# EAGLE schematic opamp1 (EAGLE 9.5.2)
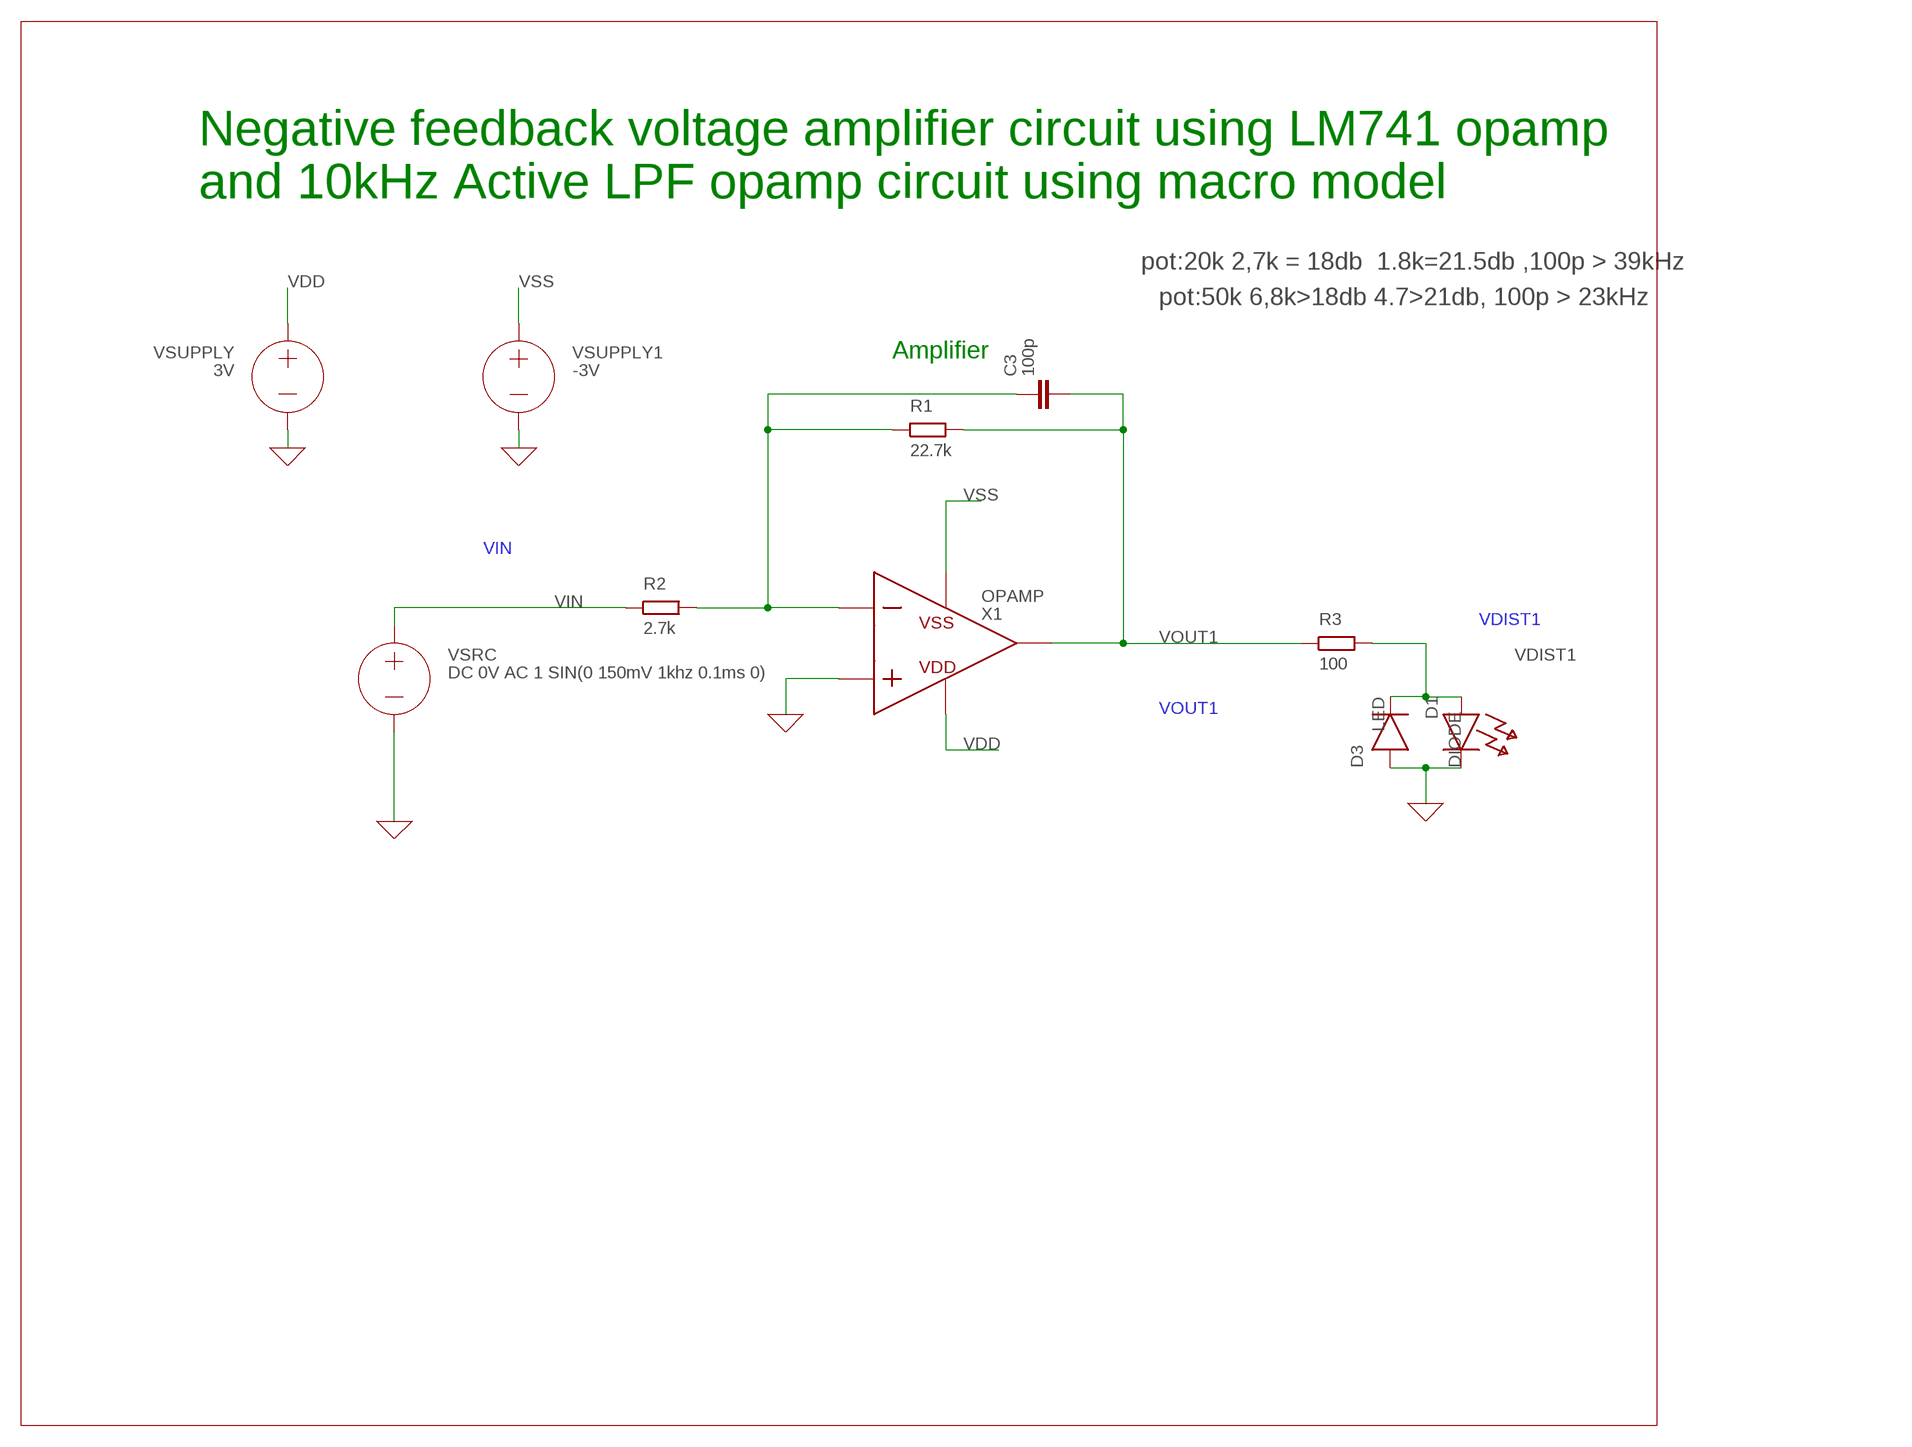
[diagram p0: schematic, sheet 1]

## Parts
C3  100p  C  (no package)
D1  LED  (no package)
D3  DIODE  (no package)
R1  22.7k  R  (no package)
R2  2.7k  R  (no package)
R3  100  R  (no package)
VSRC  DC 0V AC 1 SIN(0 150mV 1khz 0.1ms 0)  VOLTAGE  (no package)
VSUPPLY  3V  VOLTAGE  (no package)
VSUPPLY1  -3V  VOLTAGE  (no package)
X1  OPAMP  (no package)

## Nets
0: D1.C D3.A VSRC.- VSUPPLY1.- VSUPPLY.- X1.P ; supply symbol labelled GND
N$1: C3.1 R1.1 R2.2 X1.N
VDD: VSUPPLY.+ X1.VDD
VDIST1: D1.A D3.C R3.2
VIN: R2.1 VSRC.+
VOUT1: C3.2 R1.2 R3.1 X1.VOUT
VSS: VSUPPLY1.+ X1.VSS

## Notes on the sheet
- Negative feedback voltage amplifier circuit using LM741 opamp
  and 10kHz Active LPF opamp circuit using macro model
- pot:20k 2,7k = 18db  1.8k=21.5db ,100p > 39kHz
- pot:50k 6,8k>18db 4.7>21db, 100p > 23kHz
- Amplifier

## Library data of the parts
C3 = ngspice-simulation:C: CAPACITOR
D1 = ngspice-simulation:LED: Diode
D3 = ngspice-simulation:DIODE: Diode
R1-R3 = ngspice-simulation:R: RESISTOR
VSRC VSUPPLY VSUPPLY1 = ngspice-simulation:VOLTAGE: Independent Voltage Source, either DC, AC, PULSE, SINE, PWL, EXP, or SFFM; VALUE: 0V
X1 = ngspice-simulation:OPAMP: Operational amplifier with power pins